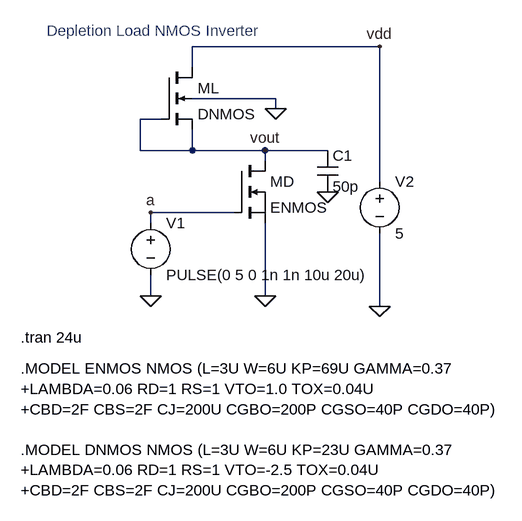
[diagram p0: schematic depletion_load_nmos_inv_347.asc]
depletion_load_nmos_inv_347.asc, the LTspice schematic file:
Version 4
SHEET 1 880 680
WIRE 512 -448 224 -448
WIRE 224 -416 224 -448
WIRE 352 -368 224 -368
WIRE 352 -352 352 -368
WIRE 176 -336 144 -336
WIRE 144 -288 144 -336
WIRE 224 -288 224 -320
WIRE 224 -288 144 -288
WIRE 336 -288 224 -288
WIRE 432 -288 336 -288
WIRE 336 -272 336 -288
WIRE 512 -240 512 -448
WIRE 288 -192 160 -192
WIRE 160 -176 160 -192
WIRE 160 -64 160 -96
WIRE 336 -64 336 -176
WIRE 512 -48 512 -160
FLAG 160 -64 0
FLAG 336 -64 0
FLAG 512 -48 0
FLAG 352 -352 0
FLAG 160 -192 a
FLAG 512 -448 vdd
FLAG 336 -288 vout
FLAG 432 -224 0
SYMBOL voltage 160 -192 R0
WINDOW 123 0 0 Left 0
WINDOW 39 0 0 Left 0
SYMATTR InstName V1
SYMATTR Value PULSE(0 5 0 1n 1n 10u 20u)
SYMBOL nmos 288 -272 R0
SYMATTR InstName MD
SYMATTR Value ENMOS
SYMBOL nmos4 176 -416 R0
SYMATTR InstName ML
SYMATTR Value DNMOS
SYMBOL voltage 512 -256 R0
SYMATTR InstName V2
SYMATTR Value 5
SYMBOL cap 416 -288 R0
SYMATTR InstName C1
SYMATTR Value 50p
TEXT -40 48 Left 2 !.MODEL ENMOS NMOS (L=3U W=6U KP=69U GAMMA=0.37\n+LAMBDA=0.06 RD=1 RS=1 VTO=1.0 TOX=0.04U\n+CBD=2F CBS=2F CJ=200U CGBO=200P CGSO=40P CGDO=40P)\n \n.MODEL DNMOS NMOS (L=3U W=6U KP=23U GAMMA=0.37\n+LAMBDA=0.06 RD=1 RS=1 VTO=-2.5 TOX=0.04U\n+CBD=2F CBS=2F CJ=200U CGBO=200P CGSO=40P CGDO=40P)
TEXT 0 -472 Left 2 ;Depletion Load NMOS Inverter
TEXT -40 0 Left 2 !.tran 24u

The netlist it stands for:
* depletion_load_nmos_inv_347.asc
V1 a 0 PULSE(0 5 0 1n 1n 10u 20u)
MD vout a 0 0 ENMOS
ML vdd vout vout 0 DNMOS
V2 vdd 0 5
C1 vout 0 50p
.model NMOS NMOS
.model PMOS PMOS
.lib standard.mos
.MODEL ENMOS NMOS (L=3U W=6U KP=69U GAMMA=0.37
+LAMBDA=0.06 RD=1 RS=1 VTO=1.0 TOX=0.04U
+CBD=2F CBS=2F CJ=200U CGBO=200P CGSO=40P CGDO=40P)
.MODEL DNMOS NMOS (L=3U W=6U KP=23U GAMMA=0.37
+LAMBDA=0.06 RD=1 RS=1 VTO=-2.5 TOX=0.04U
+CBD=2F CBS=2F CJ=200U CGBO=200P CGSO=40P CGDO=40P)
* Depletion Load NMOS Inverter
.tran 24u
.backanno
.end

* Results of the author's LTspice run, read from the files saved beside the schematic
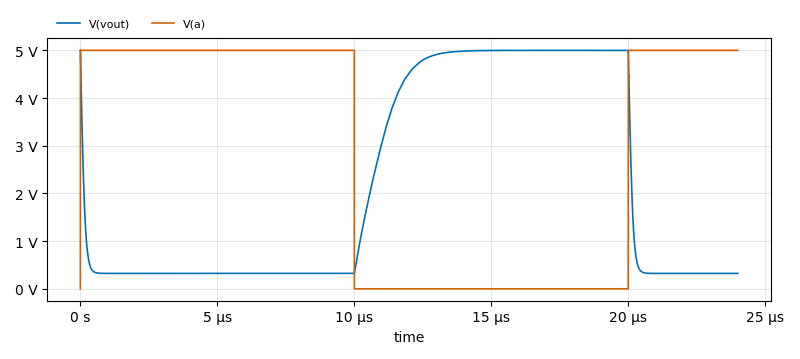
[diagram p1: Transient Analysis of depletion_load_nmos_inv_347.asc, plotted from the saved traces]
* Transient Analysis, 1 run:
*   V(vout): min 322.7 mV, max 5 V, average 2.127 V, rms 3.04 V, last 322.7 mV
*   V(a): min 0 V, max 5 V, average 2.917 V, rms 3.819 V, last 5 V